# Altium schematic sheet TCAN337 CANbus Transceiver.SchDoc: MAX33053E CANbus Transciever
size Letter; SheetNumber: 9; SheetTotal: 11
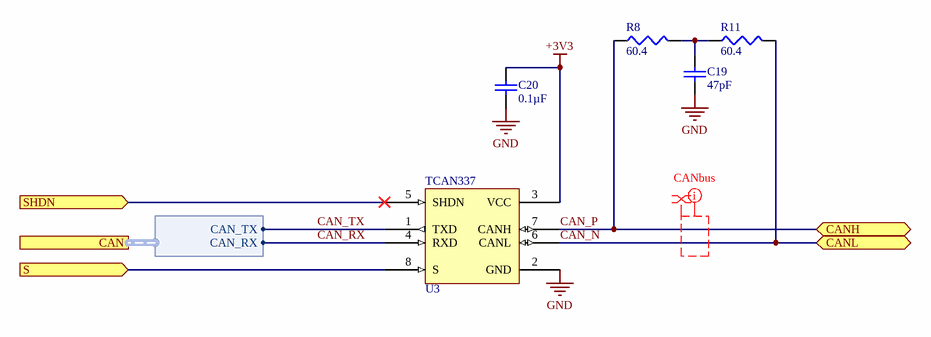
[diagram p0: TCAN337 CANbus Transceiver.SchDoc]

## Parts
C19  value 47pF  [TDK-CGA2B]  (hidden comment: Cap)
C20  value 0.1µF  [TDK-CGA2B]  (hidden comment: Cap)
R8  value 60.4  [PANA-ERA2A]  (hidden comment: Res3)
R11  value 60.4  [PANA-ERA2A]  (hidden comment: Res3)
U3  TCAN337  [TI-R-PDSO-G8]

## Ports
CAN (harness MAX33053E_CAN), CANH (bidir), CANL (bidir), S (in), SHDN (in)

## Harnesses
MAX33053E_CAN: CAN_RX, CAN_TX

## Nets
+3V3: C20.1 U3.3(VCC)
GND: C19.1 C20.2 U3.2(GND)
CAN_N: R11.2 U3.6(CANL) ; port CANL
CAN_P: R8.1 U3.7(CANH) ; port CANH
CAN_RX: U3.4(RXD) ; port CAN.CAN_RX
CAN_TX: U3.1(TXD) ; port CAN.CAN_TX
S: U3.8(S) ; port S
SHDN: U3.5(SHDN) ; port SHDN
NetC19_2: C19.2 R8.2 R11.1

## Layout directives
net class CANbus; rule Impedance Constraint [Min = 120.0    Max = 120.0    ]: (no net found under the mark)
differential pair: (no net found under the mark)

## Notes on the sheet
- (the "License"); you may not use or redistribute this file except in compliance with the License. You
- This file and the information within it are licensed under the terms of the Apache License, Version 2.0
- Copyright
- Unless required by applicable law or agreed to in writing, content distributed under the License is
- distributed on an "AS IS" BASIS, WITHOUT WARRANTIES OR CONDITIONS OF ANY KIND,
- either express or implied. See the License for the specific language governing permissions and
- limitations under the License.
- may obtain a copy of the License at:
- http://www.apache.org/licenses/LICENSE-2.0
- Title
- Size:
- Date:
- Letter
- Number:
- Time:
- Revision:
- Sheet
- of
- University of Alberta
- Deptartment of Electrical
- and Computer Engineering
- Edmonton AB, Canada
- T6G 1H9
- File:

## Library data of the parts
C19 = PC-TDK-01185: CAP CER 47PF 50V NP0 0402; Manufacturer Part Number: CGA2B2NP01H470J050BA; Index: 1185; Designator: C?; Tolerance: ±5%; Published: 2016-03-16; LatestRevisionDate: 2016-03-16; LatestRevisionNote: ...; PackageReference: 0402 (1005 Metric); Publisher: AlbertaSat; PackageDescription: Radial Cap, Thru-Hole; 2 Leads; 0.3 in Pin Spacing; Part Number: PC-TDK-01185; Supplier Part Number 1: 445-12142-1-ND; Supplier 1: Digi-key; Supplier Link: http://www.digikey.ca/product-search/en?keywords=445-12142-1-ND; Voltage - Rated: 50V; Temperature Coefficient: NP0; Applications: Automotive
C20 = PC-TDK-02259: CAP CER 0.1UF 50V X7R 0402; Manufacturer Part Number: CGA2B3X7R1H104K050BB; Index: 2259; Designator: C?; Tolerance: ±10%; Published: 2016-03-16; LatestRevisionDate: 2016-03-16; LatestRevisionNote: ...; PackageReference: 0402 (1005 Metric); Publisher: AlbertaSat; PackageDescription: Radial Cap, Thru-Hole; 2 Leads; 0.3 in Pin Spacing; Part Number: PC-TDK-02259; Supplier Part Number 1: 445-6899-1-ND; Supplier 1: Digi-key; Supplier Link: http://www.digikey.ca/product-search/en?keywords=445-6899-1-ND; Voltage - Rated: 50V; Temperature Coefficient: X7R; Applications: Automotive
R8 R11 = 13829: RES SMD 60.4 OHM 0.1% 1/16W 0402; Part Number: 13829; Manufacturer Part Number: ERA-2AEB60R4X; Designator: R?; Power: 0.063W, 1/16W; Temperature Coefficient: ±25ppm/°C; Published: 8-Jun-2000; LatestRevisionDate: 29-May-2009; LatestRevisionNote: IPC-7351 Footprint Added.; PackageReference: 0402 (1005 Metric); Publisher: Altium Limited; PackageDescription: Chip Resistor, 2-Leads, Body 1.00x0.50mm, IPC Low Density; Supplier Part Number 1: P60.4DCCT-ND; Supplier 1: Digi-Key; Supplier Link: http://www.digikey.ca/product-search/en?keywords=P60.4DCCT-ND; Tolerance: ±0.1%
U3 = 78: IC TXRX CAN 3.3V SOT23-8; Part Number: 78; Manufacturer Part Number: TCAN337GDCNR; Designator: U?; Supplier Part Number 2: 595-TCAN337GDCNR; Supplier 2: Mouser; Supplier Part Number 1: 296-48971-1-ND; Supplier 1: Digi-Key; Supplier Link: #https://www.digikey.ca/product-detail/en/texas-instruments/TCAN337GDCNR/296-48971-1-ND/8635034#; PackageReference: SOT-23-8; Operating Temperature: -40°C ~ 125°C